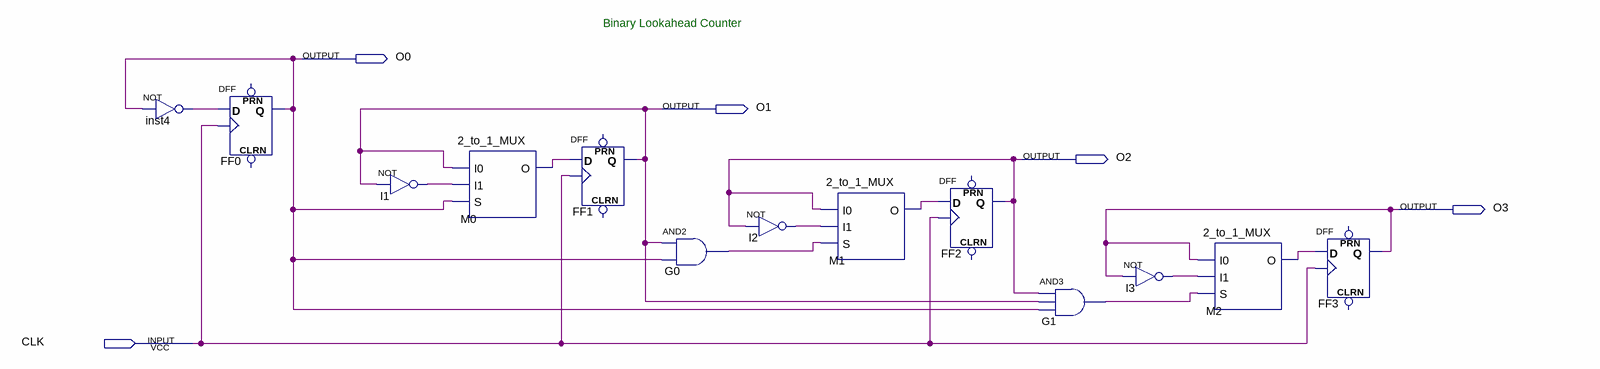
[diagram p0: schematic sheet]
// Quartus schematic 4_bit_binary_counter.bdf as structural Verilog: 13 symbols, 5 pins
module \4_bit_binary_counter  (
  input  CLK,
  output O0,
  output O1,
  output O2,
  output O3
);

  wire G0_out, G1_out, I1_out, I2_out, I3_out, inst4_out, M0_o, M1_o, M2_o;

  not inst4 (inst4_out, O0);
  DFF FF0 (.CLK(CLK), .D(inst4_out), .Q(O0));  // open: CLRN, PRN
  not I1 (I1_out, O1);
  \2_to_1_MUX  M0 (.I0(O1), .I1(I1_out), .S(O0), .O(M0_o));
  DFF FF1 (.CLK(CLK), .D(M0_o), .Q(O1));  // open: CLRN, PRN
  and G0 (G0_out, O1, O0);
  not I2 (I2_out, O2);
  \2_to_1_MUX  M1 (.I0(O2), .I1(I2_out), .S(G0_out), .O(M1_o));
  DFF FF2 (.CLK(CLK), .D(M1_o), .Q(O2));  // open: CLRN, PRN
  and G1 (G1_out, O2, O1, O0);
  not I3 (I3_out, O3);
  \2_to_1_MUX  M2 (.I0(O3), .I1(I3_out), .S(G1_out), .O(M2_o));
  DFF FF3 (.CLK(CLK), .D(M2_o), .Q(O3));  // open: CLRN, PRN

  // Notes on the sheet:
  //   Binary Lookahead Counter
endmodule
